# EAGLE design NinjaPCR-PowerSupply (EAGLE 6.3)
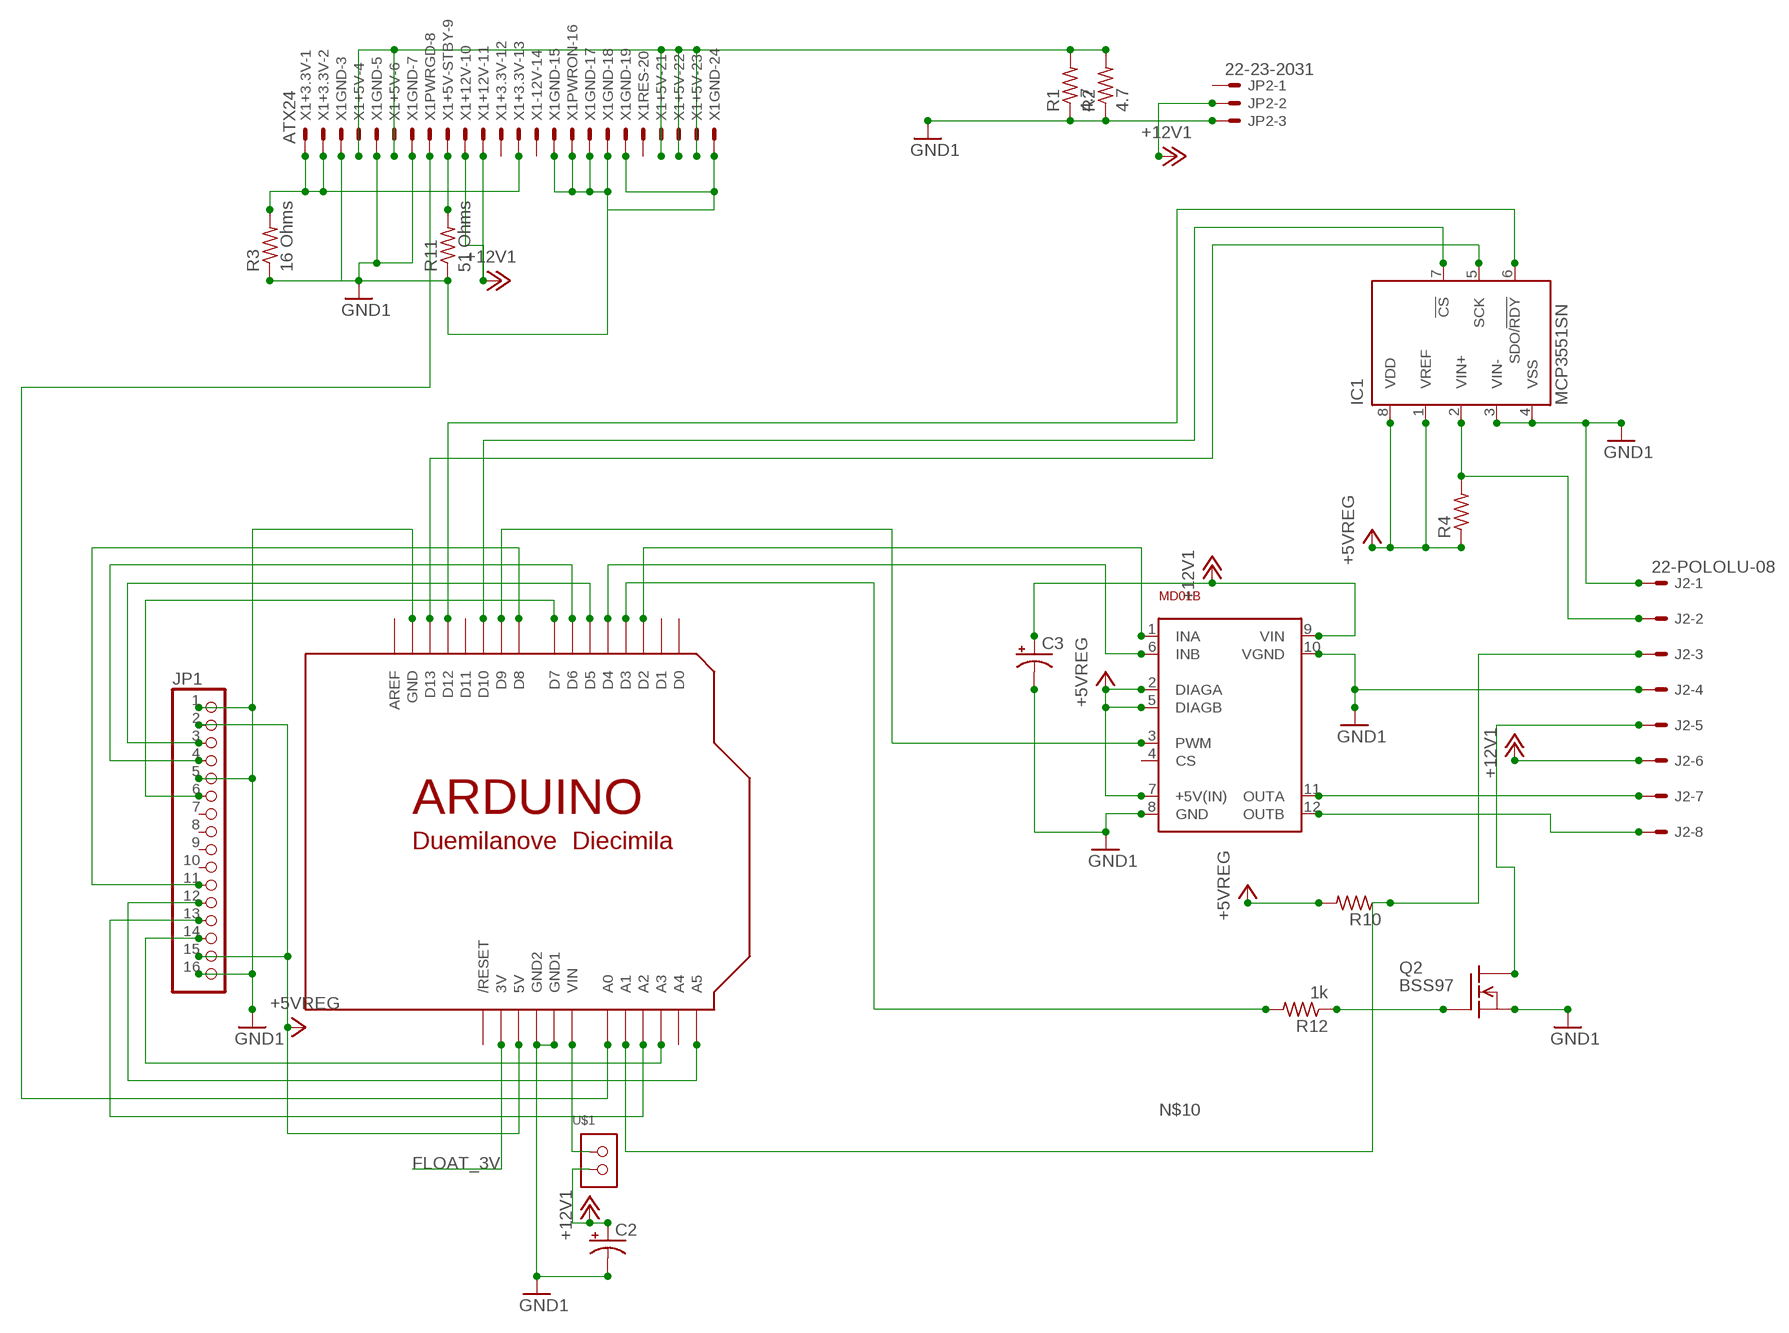
[diagram p0: schematic, sheet 1]

## Parts
C2  CPOL-USE5-8.5  [E5-8,5]
C3  CPOL-USE5-13  [E5-13]
IC1  MCP3551SN  [SO-08]
J2  22-POLOLU-08  [POLOLU-8]
JP1  PINHD-1X16/90  [1X16/90]
JP2  22-23-2031  [22-23-2031]
MD01B  VNH3SP30+4PIN  [VNH3SP30+4PIN]
Q2  BSS97  [TO202]
R1  4.7  PR1  [PR1]
R2  4.7  PR1  [PR1]
R3  16 Ohms  R-US_0414/15  [0414/15]
R4  R-US_0207/12  [0207/12]
R10  R-US_0207/12  [0207/12]
R11  51 Ohms  R-US_0207/12  [0207/12]
R12  1k  R-US_0207/10  [0207/10]
U$1  1X02  [1X02_1.1_UNSIGNED]
U$3  ARDUINODUEMILANOVE  [ARDUINO]
X1  ATX24  [ATX24]

## Nets
+3.3V [2A]: R3.2 X1.1 X1.2 X1.13
+5V [3A]: R1.2 R2.2 X1.4 X1.6 X1.21 X1.22 X1.23
+5VREG [2A]: IC1.1(VREF) IC1.8(VDD) JP1.2 JP1.15 MD01B.2(DIAGA) MD01B.5(DIAGB) MD01B.7(+5V(IN)) R4.1 R10.2 U$3.5V
+5VSTBY: R11.2 X1.9
+12V1 [8A]: C2.+ C3.+ J2.6 JP2.2 MD01B.9(VIN) U$1.2 X1.10 X1.11
D5: JP1.3 U$3.D5
D6: JP1.4 U$3.D6
D13: IC1.5(SCK) U$3.D13
FLOAT_3V: U$3.3V
GND1 [2A]: C2.- C3.- IC1.3(VIN-) IC1.4(VSS) J2.1 J2.4 JP1.1 JP1.5 JP1.16 JP2.3 MD01B.8(GND) MD01B.10(VGND) Q2.1(S) R1.1 R2.1 R3.1 R11.1 U$3.GND U$3.GND1 U$3.GND2 X1.3 X1.5 X1.7 X1.15 X1.16 X1.17 X1.18 X1.19 X1.24
N$1: U$3.A0 X1.8
N$4: JP1.14 U$3.A3
N$5: U$1.1 U$3.VIN
N$8: R12.2 U$3.D3
N$10: JP1.13 U$3.A2
N$11: JP1.6 U$3.D7
N$12: JP1.12 U$3.A5
N$18 [3A]: J2.5 Q2.2(D)
N$20: JP1.11 U$3.D8
N$23: IC1.2(VIN+) J2.2 R4.2
N$25 [8A]: J2.7 MD01B.11(OUTA)
N$27: IC1.6(SDO/!RDY) U$3.D12
N$29: IC1.7(!CS) U$3.D10
N$32 [8A]: J2.8 MD01B.12(OUTB)
N$37: J2.3 R10.1 U$3.A1
S$1: MD01B.1(INA) U$3.D2
S$2: MD01B.3(PWM) U$3.D9
S$3: MD01B.6(INB) U$3.D4
T1: Q2.3(G) R12.1
Unconnected: JP1.7 JP1.8 JP1.9 JP1.10 JP2.1 MD01B.4(CS) U$3.A4 U$3.AREF U$3.D0 U$3.D1 U$3.D11 U$3.RESET(/RESET) X1.12 X1.14 X1.20

## Library data of the parts
C2 C3 = rcl:CPOL-US: POLARIZED CAPACITOR, American symbol
IC1 = microchip:MCP355*: Low-Power, Single-Channel 22-Bit Delta-Sigma ADCs Source: http://ww1.microchip.com/downloads/en/DeviceDoc/21950c.pdf; MPN: MCP3551-E/SN; OC_FARNELL: 1084625; OC_NEWARK: 97K4494
J2 = con-molex:22-?-08: CONNECTOR wire to board 2.54 mm (.1 inch) pitch header
JP1 = pinhead:PINHD-1X16: PIN HEADER
JP2 = con-molex:22-23-2031: .100" (2.54mm) Center Header - 3 Pin; MF: MOLEX; MPN: 22-23-2031; OC_FARNELL: 1462950; OC_NEWARK: 30C0862
MD01B = MOTORDRIVE:VNH3SP30+4PIN
Q2 = openpcr:BSS97: N-Channel Enhancement MOSFET 200V; 1.5A; 1,6Ohm
R1 R2 = openpcr:PR1
R3 R4 R10 R12 = resistor:R-US_: RESISTOR, American symbol
R11 = rcl:R-US_: RESISTOR, American symbol
U$1 = PIN:1X02
U$3 = openpcr:ARDUINO: Arduino Diecimila/Duemilanove Make a shield with ease, this package has all the named pins as well as the two mounting drill holes and an outline of the USB and DC power connector. The outline is on the DIMENSION layer, so if your board house uses it they will cut the outline to match. http://www.ladyada.net/library/pcb/eaglelibrary.html
X1 = openpcr:ATX24: Mini FIT connector 24 pol Source: http://www.molex.com; OC_FARNELL: unknown; OC_NEWARK: unknown

## Net classes
0 default: width 0.381 mm
1 2A: width 0.762 mm
2 8A: width 2.54 mm
3 3A: width 1.016 mm

## Board
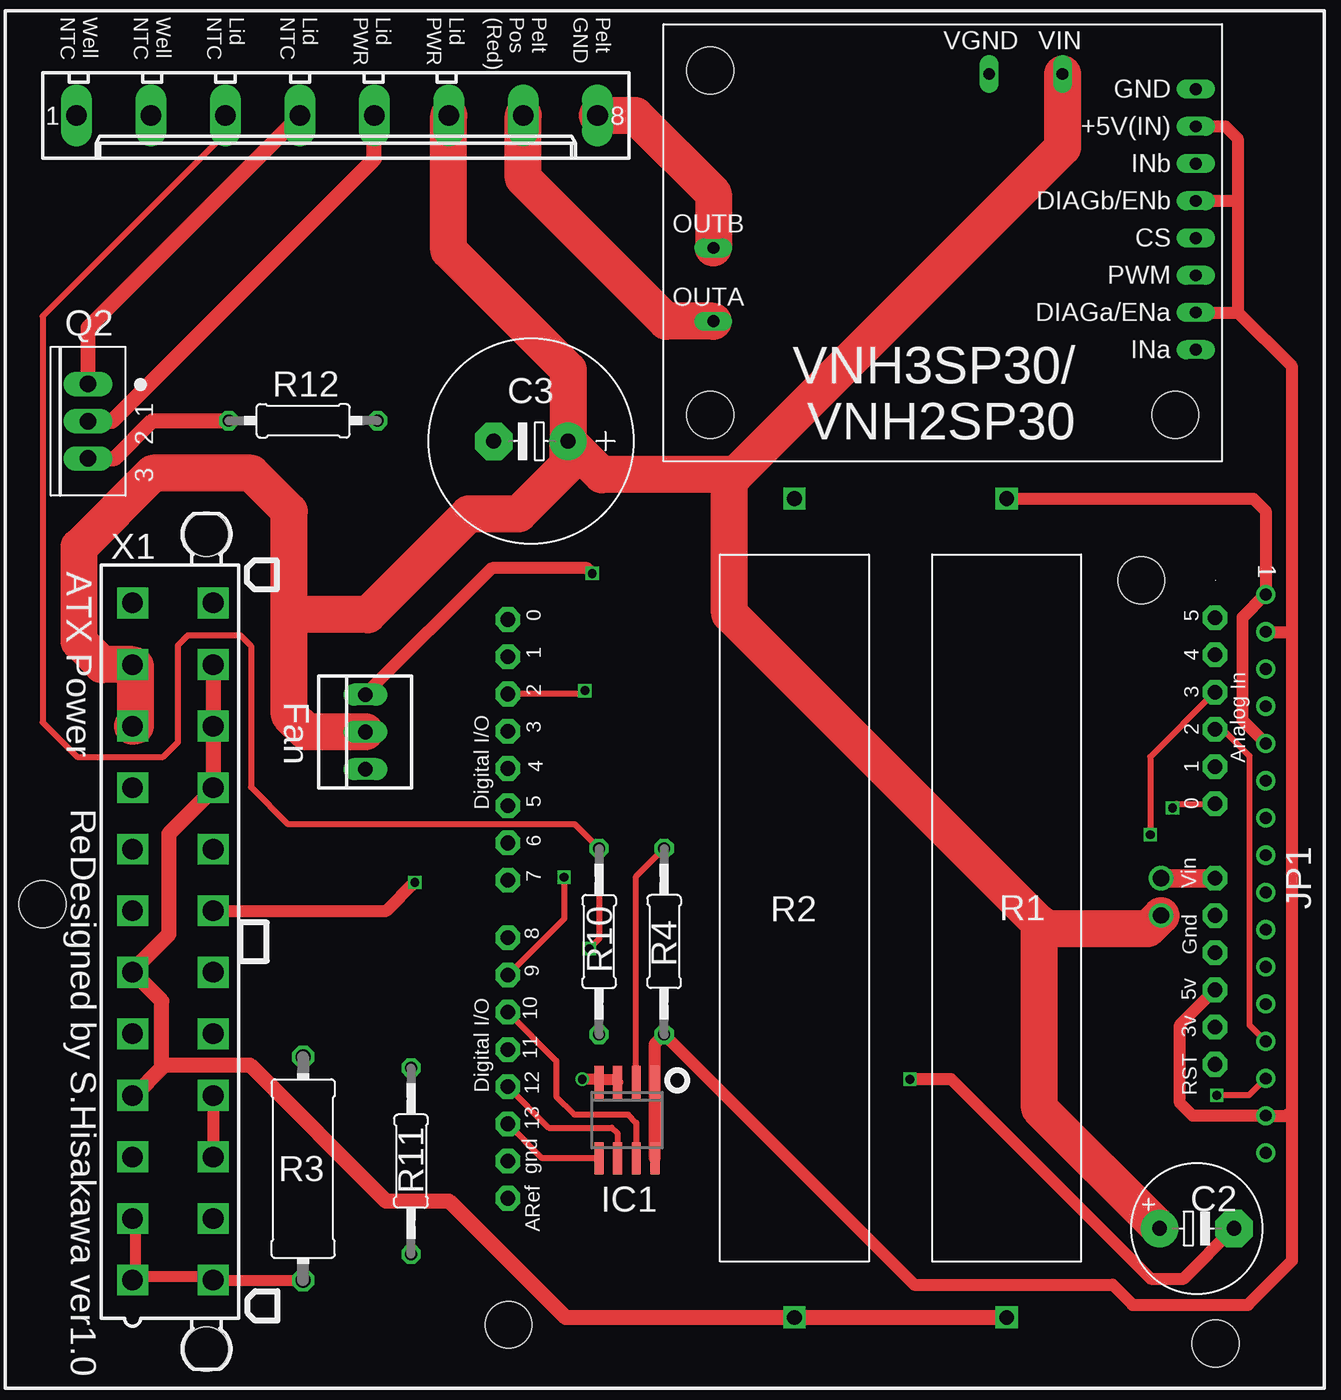
[diagram p1: board, top side]
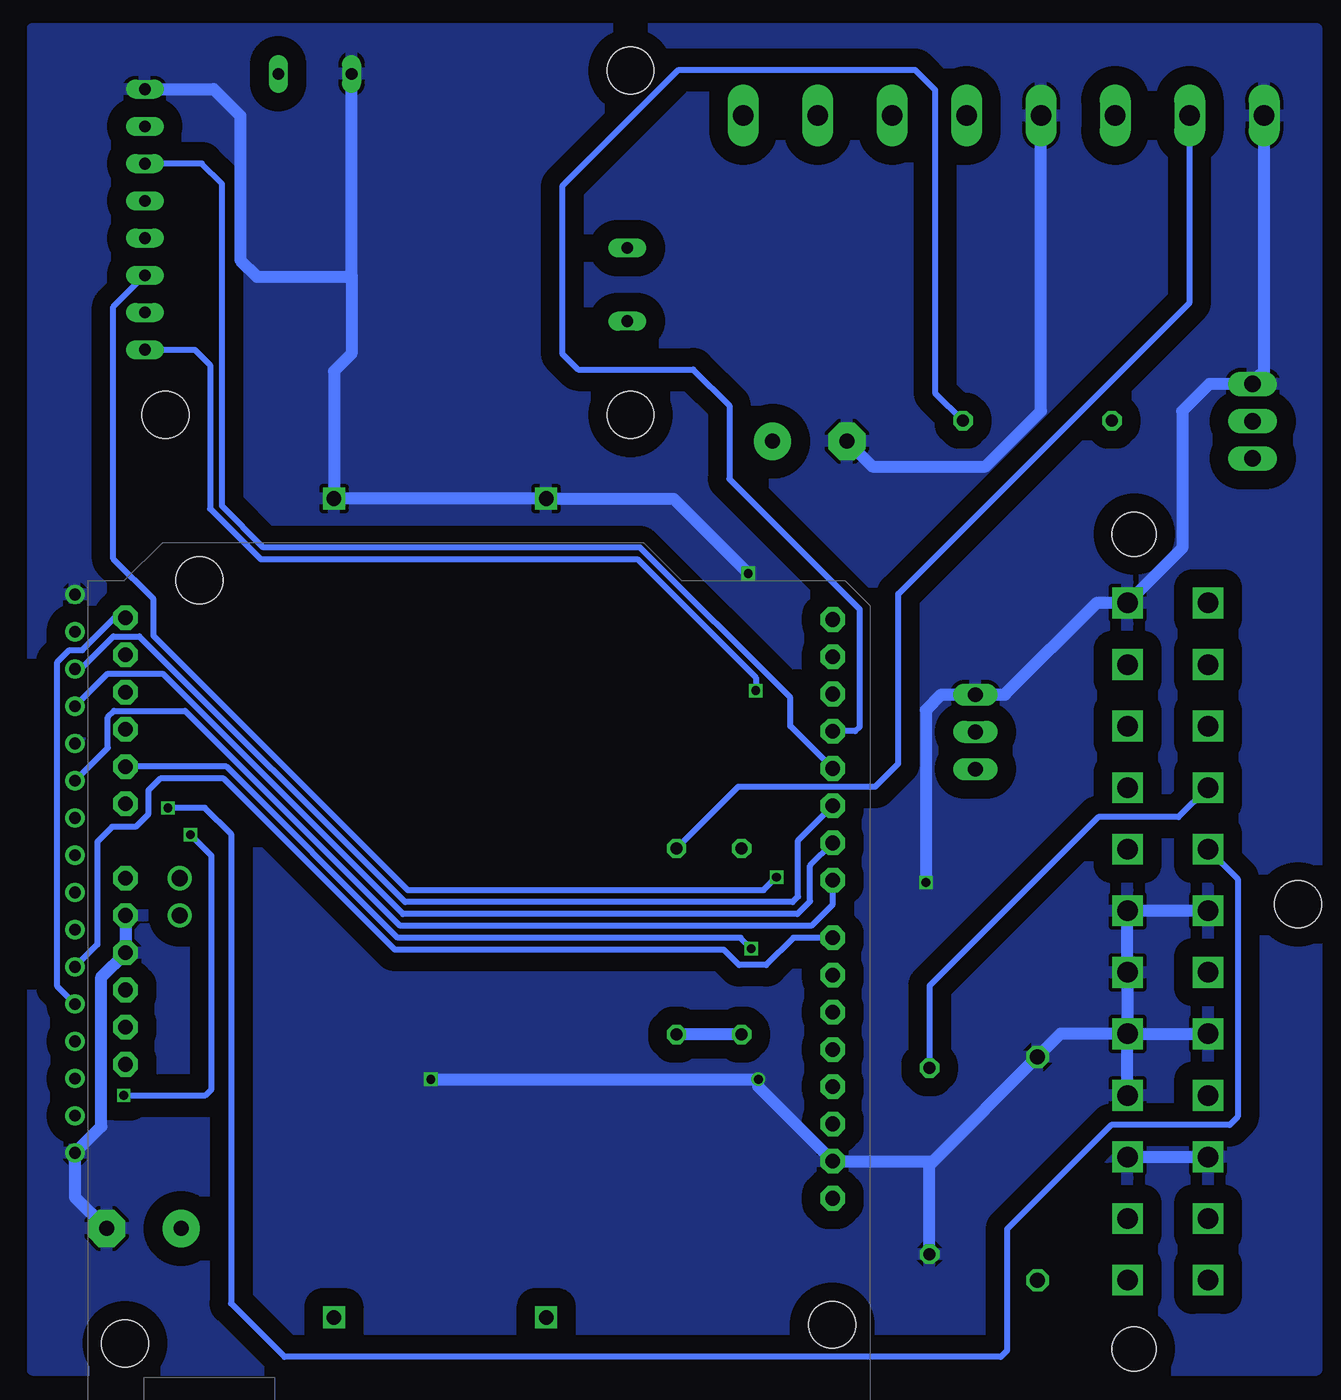
[diagram p2: board, bottom side, seen from below]

No outline drawn. Coordinates in mm, seen from the top.
Copper layers (1*16): Top 0.035mm / dielectric 1.5mm / Bottom 0.035mm
Design rules "Fusion_eagle_rule_v1.1": minimum track width 6mil, minimum drill 12mil, track to track 6mil, track to pad 6mil, pad to pad 6mil, via to via 6mil, smd to smd 0mil, copper to edge 10mil, drill to drill 10mil, minimum pad ring 10mil, minimum via ring 6mil, stop-mask expansion 2mil, vias tented up to drill 100mil, thermal gap 10mil
Holes 3.2 mm at 2.54,33.02

### Footprints (pad centres in the part's own frame; a part is rotated, then mirrored left to right if it is on the bottom)
E5-8,5 = drill 1.016 pad 2.54: + -2.54,0 | drill 1.016 pad 2.54 octagon: - 2.54,0
E5-13 = drill 1.016 pad 2.54: + -2.54,0 | drill 1.016 pad 2.54 octagon: - 2.54,0
SO-08 = smd 0.6 x 2.2: 1 -1.905,-2.6; 2 -0.635,-2.6; 3 0.635,-2.6; 4 1.905,-2.6; 5 1.905,2.6; 6 0.635,2.6; 7 -0.635,2.6; 8 -1.905,2.6
POLOLU-8 = drill 1.4 long: 1 17.78,0; 2 12.7,0; 3 7.62,0; 4 2.54,0; 5 -2.54,0; 6 -7.62,0; 7 -12.7,0; 8 -17.78,0
1X16_0.8_UNSIGNED = drill 0.8: 1 -19.05,0; 2 -16.51,0; 3 -13.97,0; 4 -11.43,0; 5 -8.89,0; 6 -6.35,0; 7 -3.81,0; 8 -1.27,0; 9 1.27,0; 10 3.81,0; 11 6.35,0; 12 8.89,0; 13 11.43,0; 14 13.97,0; 15 16.51,0; 16 19.05,0
22-23-2031 = drill 1 long: 1 -2.54,0; 2 0,0; 3 2.54,0
VNH3SP30+4PIN = drill 0.8 long: 1 1.778,22.225; 2 1.778,19.685; 3 1.778,17.145; 4 1.778,14.605; 5 1.778,12.065; 6 1.778,9.525; 7 1.778,6.985; 8 1.778,4.445; 9 10.886,3.4; 10 15.886,3.4; 11 34.7,20.28; 12 34.7,15.28 | hole 3.2: 3.175,26.67; 34.925,26.67; 34.925,3.175
TO202 = drill 1.118 long: 1 -2.54,-5.08; 2 0,-5.08; 3 2.54,-5.08
PR1 = drill 1 square: 1 -27.94,0; 2 27.94,0
0414/15 = drill 1.016 octagon: 1 -7.62,0; 2 7.62,0
0207/12 = drill 0.813 octagon: 1 -6.35,0; 2 6.35,0
0207/10 = drill 0.813 octagon: 1 -5.08,0; 2 5.08,0
1X02_1.1_UNSIGNED = drill 1.1: 1 -2.54,0; 2 0,0
ARDUINO = drill 1 pad 1.676 octagon: 3V 36.068,2.54; 5V 38.608,2.54; A0 51.308,2.54; A1 53.848,2.54; A2 56.388,2.54; A3 58.928,2.54; A4 61.468,2.54; A5 64.008,2.54; AREF 24.384,50.8; D0 63.881,50.8; D1 61.341,50.8; D2 58.801,50.8; D3 56.261,50.8; D4 53.721,50.8; D5 51.181,50.8; D6 48.641,50.8; D7 46.101,50.8; D8 42.164,50.8; D9 39.624,50.8; D10 37.084,50.8; D11 34.544,50.8; D12 32.004,50.8; D13 29.464,50.8; GND 26.924,50.8; GND1 43.688,2.54; GND2 41.148,2.54; RESET 33.528,2.54; VIN 46.228,2.54 | hole 3.2: 15.758,50.754; 66.558,7.574; 14.488,2.494
ATX24 = drill 1.4 square: 1 23.1,-2.75; 2 18.9,-2.75; 3 14.7,-2.75; 4 10.5,-2.75; 5 6.3,-2.75; 6 2.1,-2.75; 7 -2.1,-2.75; 8 -6.3,-2.75; 9 -10.5,-2.75; 10 -14.7,-2.75; 11 -18.9,-2.75; 12 -23.1,-2.75; 13 23.1,2.75; 14 18.9,2.75; 15 14.7,2.75; 16 10.5,2.75; 17 6.3,2.75; 18 2.1,2.75; 19 -2.1,2.75; 20 -6.3,2.75; 21 -10.5,2.75; 22 -14.7,2.75; 23 -18.9,2.75; 24 -23.1,2.75 | hole 3: 27.8,2.29; -27.8,2.29

### Placement (x,y rotation side)
C2  81.31,10.9 0 top
C3  35.86,64.62 180 top
IC1  42.42,18.29 180 top
J2  22.63,86.85 180 top
JP1  [1X16_0.8_UNSIGNED]  86,35.1 270 top
JP2  24.56,44.78 90 top
MD01B  83.02,93.09 180 top
Q2  10.72,65.99 270 top
R1  68.33,32.77 270 top
R2  53.85,32.77 270 top
R3  20.32,14.99 270 top
R4  44.96,30.48 90 top
R10  40.51,30.48 270 top
R11  27.69,15.49 90 top
R12  20.32,66.01 0 top
U$1  78.87,32.26 270 top
U$3  85.09,-11.43 90 top
X1  11.43,30.48 270 top

### Tracks (layer width: path | path; a pad name or v marks a point on that pad's centre or on a via)
+3.3V
  Top 0.762: X1.2 8.89,11.43 8.89,7.62 X1.1 9.14,7.62 13.97,7.62 X1.13 14.22,7.37 R3.2
+5V
  Top 1.016: X1.22 14.22,44.96 | X1.22 14.22,45.47 | X1.22 14.22,44.45 14.22,41.15 X1.21 13.97,40.64 11.18,37.85 11.18,30.99 8.89,28.7 X1.6 8.89,28.19 10.67,26.42 10.67,21.84 | X1.23 14.22,49.28 14.22,45.97 X1.22 | R2.2 R1.2 | 10.67,21.84 8.89,20.07 X1.4 | 53.59,5.08 R2.2 | 10.67,21.84 10.87,22.05 16.69,22.05 25.96,12.78 30.28,12.78 38.23,4.83 R2.2
+5VREG
  Top 0.813: IC1.8 IC1.1 44.32,23.5 R4.1 62.03,7.06 75.56,7.06 76.94,5.69 84.78,5.69 87.81,8.71 87.81,18.97 | U$3.5V 80.16,24.79 80.16,19.46 81.03,18.59 JP1.15 87.43,18.59 87.81,18.97 | MD01B.7 83.26,86.11 84.1,85.27 84.1,81.03 | 84.1,81.03 84.1,73.41 | MD01B.5 84.1,81.03 | MD01B.2 84.1,73.41 | 87.81,18.97 87.81,51.61 | 87.81,51.61 87.81,69.7 84.1,73.41 | JP1.2 87.81,51.61
  Bottom 0.813: R10.2 R4.1
+5VSTBY
  Bottom 0.406: X1.9 10.7,38.96 16.18,38.96 27.69,27.46 R11.2
+12V1
  Top 2.54: X1.10 8.89,45.21 8.89,49.28 X1.11 6.6,49.38 5.03,50.95 5.03,57.4 10.06,62.43 16.79,62.43 19.38,59.84 19.38,53.06 | MD01B.9 72.13,84.65 49.81,62.33 49.45,62.33 | JP2.2 20.55,44.78 19.38,45.95 19.38,53.06 | 70.56,31.34 70.56,31.67 70.56,31.73 49.43,52.86 49.43,62.31 49.45,62.33 | U$1.2 77.95,31.34 70.56,31.34 | C3.+ 38.41,69.49 30.25,77.65 J2.6 | C3.+ 38.41,63.04 35.03,59.66 31.62,59.66 24.74,52.78 19.66,52.78 19.38,53.06 | 49.45,62.33 40.69,62.33 C3.+ | C2.+ 70.56,19.1 70.56,31.34
D5
  Bottom 0.406: U$3.D5 36.65,37.39 36.65,33.55 37.03,33.17 63.48,33.17 81.61,51.31 83.39,51.31 85.62,49.07 JP1.3
D6
  Bottom 0.406: JP1.4 83.77,48.77 80.03,48.77 63.63,32.36 36.7,32.36 35.84,33.22 35.84,35.66 U$3.D6
D13
  Top 0.406: IC1.5 36.64,15.69 U$3.D13
GND1  (via drill 0.6, 0.61)
  Top 0.762: IC1.3 41.66,21.08 40.64,21.08 IC1.4 40.39,21.08 v39.37,21.08
  Top 0.813: X1.16 X1.15 | JP1.5 84.43,45.57 84.43,52.6 85.98,54.15 JP1.1 86,59.87 85.17,60.71 R1.1 | v40.06,55.6 39.7,55.96 33.2,55.96 JP2.3 | X1.19 26,32.58 v27.94,34.52 | v61.72,21.08 64.54,21.08 78.16,7.47 80.42,7.47 C2.-
  Top 1.016: Q2.1 5.64,72.36 20.09,86.81 J2.4
  Bottom 0.813: X1.7 X1.19 X1.18 X1.17 | X1.17 X1.5 | X1.17 18.75,24.18 R3.1 27.43,15.49 | X1.16 X1.17 | X1.15 X1.3 | R11.1 27.69,15.24 27.43,15.49 | 27.43,15.49 U$3.GND 39.37,20.57 v39.37,21.08 v61.72,21.08 | 67.13,76 MD01B.10 | U$3.GND1 U$3.GND2 84.2,28.07 84.2,17.86 JP1.16 86,13.06 C2.- | v40.06,55.6 45.16,60.71 R2.1 R1.1 68.33,69.39 67.13,70.59 67.13,76 | MD01B.8 76.55,88.64 74.73,86.82 74.73,76.99 73.58,75.84 67.28,75.84 67.13,76 | Q2.1 8.59,68.53 10.44,66.67 10.44,57.32 X1.24 16.27,53.58 22.53,47.32 JP2.3 26.9,47.32 27.94,46.28 v27.94,34.52 | C3.- 31.6,62.89 23.88,62.89 20.09,66.68 J2.4 | 5.13,69.04 4.85,69.32 J2.1
  Bottom 1.016: 5.13,69.04 Q2.1
  pour Bottom (isolate 1.27, rank 6): 1.27,92.74 88.9,92.74 88.9,1.27 1.27,1.27
N$1  (via drill 0.6)
  Top 0.406: v79.65,39.6 79.93,39.88 U$3.A0
  Bottom 0.406: X1.8 6.66,34.76 6.66,18.52 7.21,17.96 15.29,17.96 22.4,10.85 22.4,2.56 22.84,2.13 71.7,2.13 75.36,5.79 75.36,37.82 77.14,39.6 v79.65,39.6
N$4  (via drill 0.6)
  Top 0.406: JP1.14 84.86,19.99 v82.68,19.99 | U$3.A3 78.13,43.08 v78.13,37.77
  Bottom 0.406: v82.68,19.99 77.09,19.99 76.68,20.4 76.68,36.32 v78.13,37.77
N$5
  Top 1.27: U$1.1 U$3.VIN
N$8
  Bottom 0.406: U$3.D3 32.77,44.83 32.46,45.14 32.46,53.16 41.35,62.05 41.35,67.06 43.81,69.52 51.66,69.52 52.76,70.61 52.76,82.02 44.81,89.97 28.68,89.97 27.3,88.59 27.3,67.92 R12.2
N$10
  Top 0.406: U$3.A2 83.08,44.96 84.89,43.16 84.89,24.79 JP1.13
N$11
  Bottom 0.406: U$3.D7 34.29,33.02 35.76,31.55 63.8,31.55 78.49,46.23 83.34,46.23 83.77,45.8 83.77,43.69 JP1.6
N$12
  Bottom 0.406: JP1.12 87.2,27.41 87.2,49.55 86.39,50.37 85.5,50.37 83.29,52.58 U$3.A5
N$18
  Top 1.016: Q2.2 7.29,65.99 25.17,83.87 J2.5
N$20
  Bottom 0.406: U$3.D8 36.98,30.73 38.84,28.88 40.69,28.88 41.73,29.92 64.16,29.92 75.84,41.6 80.19,41.6 80.97,40.82 80.97,39.19 81.86,38.3 83.46,38.3 84.48,37.29 84.48,30.28 JP1.11
N$23
  Top 0.406: IC1.2 43.05,34.92 R4.2
  Bottom 0.406: R4.2 40.74,41.05 31.39,41.05 29.82,42.62 29.82,54.2 9.93,74.09 J2.2
N$25
  Top 2.54: MD01B.11 45.1,72.81 35.33,82.58 J2.7
N$27
  Top 0.406: U$3.D12 37.08,17.78 41.38,17.78 41.78,17.37 IC1.6
N$29
  Top 0.406: U$3.D10 37.59,22.35 37.59,19.89 38.81,18.67 42.49,18.67 43.05,18.11 IC1.7
N$32
  Top 2.54: MD01B.12 48.32,81.5 42.97,86.85 J2.8
N$37  (via drill 0.6)
  Top 0.406: 40.51,36.85 R10.1 | R10.1 40.51,30.66 v39.85,30 | R10.1 38.86,38.48 19.3,38.48 16.76,41.02 16.76,50.65 16.03,51.38 12.47,51.38 11.79,50.7 11.79,44.09 10.77,43.08 4.9,43.08 2.54,45.44 2.54,73.15 15.01,85.62 J2.3
  Bottom 0.406: v39.85,30 40.59,30.73 63.98,30.73 75.67,42.42 U$3.A1
S$1  (via drill 0.6)
  Top 0.406: v39.55,47.6 39.32,47.37 U$3.D2
  Bottom 0.406: MD01B.1 77.82,70.86 76.78,69.83 76.78,60.02 73.33,56.57 47.62,56.57 39.55,48.49 v39.55,47.6
S$2  (via drill 0.6)
  Top 0.406: v38.12,34.87 38.12,32.03 U$3.D9
  Bottom 0.406: v38.12,34.87 39.01,33.98 63.3,33.98 80.64,51.33 80.64,53.85 83.39,56.59 83.39,73.79 MD01B.3
S$3
  Bottom 0.406: U$3.D4 37.19,45.19 37.19,47.12 47.45,57.38 73.15,57.38 75.97,60.2 75.97,82.19 77.34,83.56 MD01B.6
T1
  Top 1.016: Q2.3 7.47,63.45 10.03,66.02 R12.1

### Text on the board
tPlace: Well / NTC | Well / NTC | Lid / NTC | Lid / NTC | Lid / PWR | Lid / PWR | Pelt / Pos / (Red) | Pelt / GND | Q2 | R12 | C3 | X1 | ATX Power | ReDesigned by S.Hisakawa ver1.0 | JP1 | R2 | R1 | R4 | R10 | R3 | R11 | IC1 | C2
_tsilk: 1 | Fan